# Altium project Mach_bao_khoi.PrjPcb
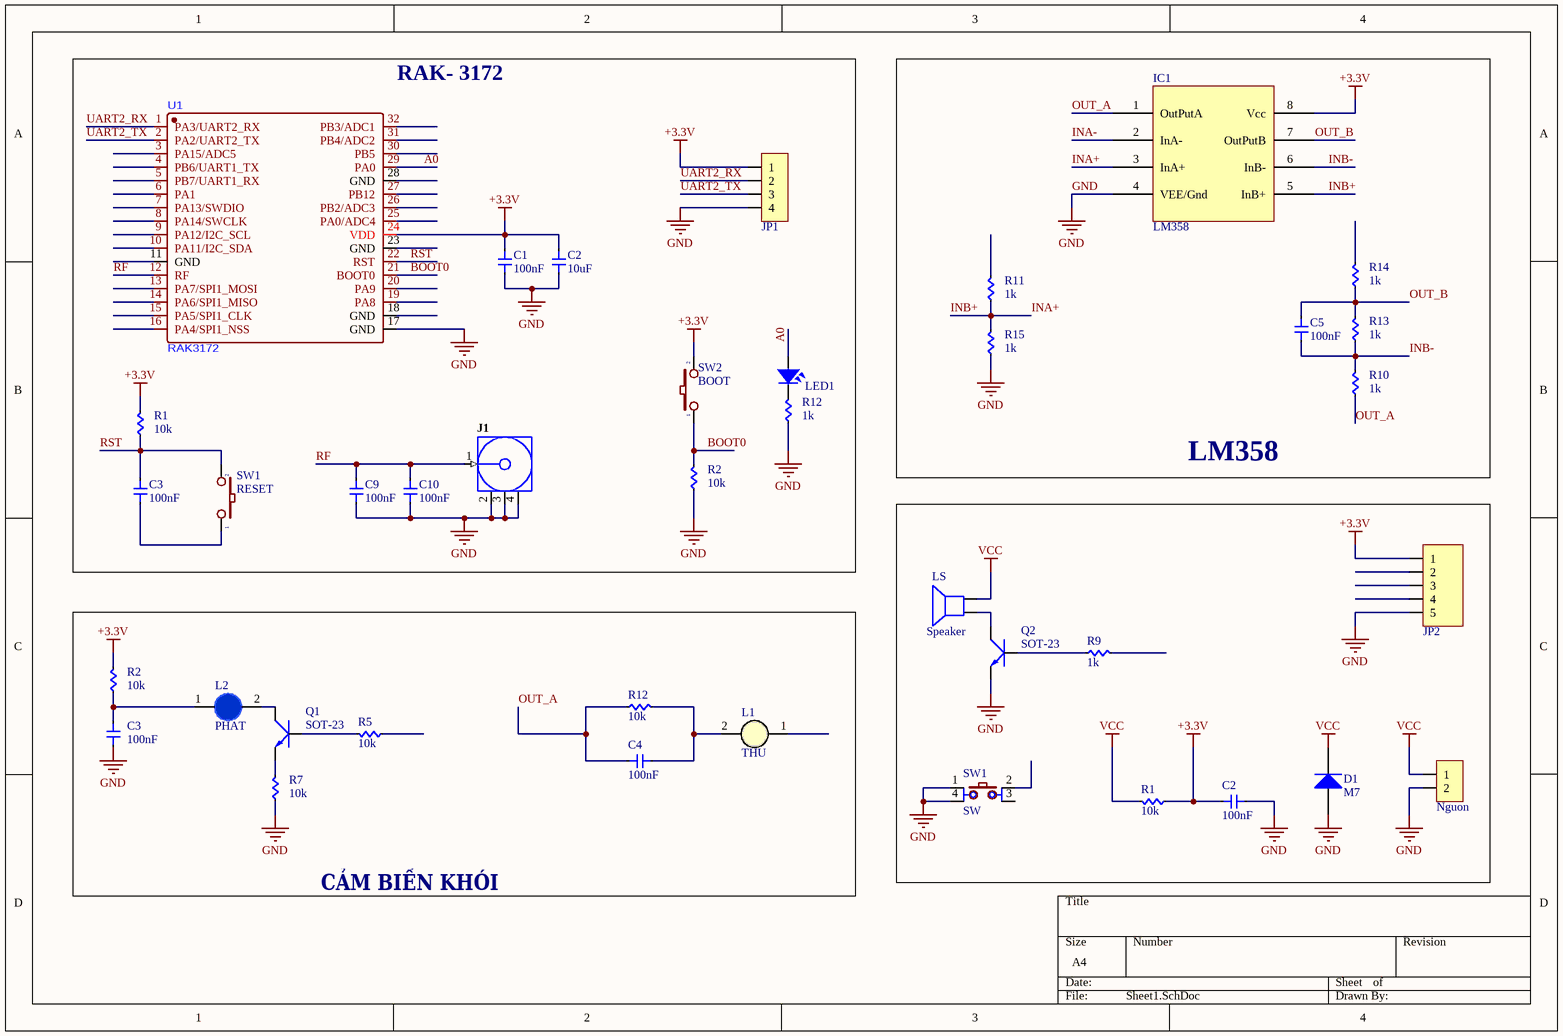
[diagram p0: Sheet1.SchDoc]
1 sheet, 39 parts. Net scope: global (net labels, ports and power ports of the same name join across sheets).
Board file: PCB1.PcbDoc

## Sheet Sheet1.SchDoc
size A4; SheetNumber: 1; SheetTotal: 1

### Parts
(Parts that share a designator on the sheet are numbered #1, #2 ... from top to bottom, then left to right.)
C1  100nF  [Cap 0603]
C2#1  10uF  [Cap 0603]
C2#2  100nF  [Cap 0603]
C3#1  100nF  [Cap 0603]
C3#2  100nF  [Cap 0603]
C4  100nF  [Cap 0603]
C5  100nF  [Cap 0603]
C9  100nF  [Cap 0603]
C10  100nF  [Cap 0603]
D1  M7  [DIODE SMA]
IC1  LM358  [SOP 8]
J1  (no value)  [CON RF]
JP1  JP1  [JP 1x4 DT]
JP2  JP2  [JP 1x5 DT]
JP?  Nguon  [JP 1x2 DT]
L1  THU  [LED-5MM-WHITE]
L2  PHAT  [LED-5MM-BLUE]
LED1  LED  [LED-0805-Green]  (value not drawn)
LS  Speaker  [Coi Chip Speacker]
Q1  SOT-23  [SOT-23]
Q2  SOT-23  [SOT-23]
R1#1  10k  [RES 0603]
R1#2  10k  [RES 0603]
R2#1  10k  [RES 0603]
R2#2  10k  [RES 0603]
R5  10k  [RES 0603]
R7  10k  [RES 0603]
R9  1k  [RES 0603]
R10  1k  [RES 0603]
R11  1k  [RES 0603]
R12#1  1k  [RES 0603]
R12#2  10k  [RES 0603]
R13  1k  [RES 0603]
R14  1k  [RES 0603]
R15  1k  [RES 0603]
SW1#1  RESET  [SW1-SMD]
SW1#2  SW  [SW2-DIP]
SW2  BOOT  [SW1-SMD]
U1  RAK3172  [LCC-40_L15.6-W15.0-P1.00_RAK3172]

### Blocks framed on the sheet
RAK- 3172: C1 C2#1 C3#1 C9 C10 J1 JP1 LED1 R1#1 R2#1 R12#1 SW1#1 SW2 U1
LM358: C5 IC1 R10 R11 R13-R15
CẢM BIẾN KHÓI: C3#2 C4 L1 L2 Q1 R2#2 R5 R7 R12#2

### Nets
+3.3V: C1.2 C2#1.1 C2#2.1 IC1.8(Vcc) JP1.1 JP2.1 R1#1.2 R1#2.1 R2#2.2 SW2.2 U1.24(VDD)
GND: C1.1 C2#1.2 C2#2.2 C3#2.1 C9.2 C10.1 D1.1(A) IC1.4(VEE/Gnd) J1.2(GND) J1.3(GND) J1.4(GND) JP1.4 JP2.5 JP?.2 Q2.2(E) R2#1.1 R7.1 R12#1.1 R15.1 SW1#2.1 SW1#2.4 U1.17(GND)
VCC: D1.2(K) JP?.1 LS.2 R1#2.2
A0: LED1.1 U1.29(PA0)
BOOT0: R2#1.2 SW2.1 U1.21(BOOT0)
INA+: IC1.3(InA+) IC1.5(InB+) R11.1 R15.2  [also labelled INB+]
INA-: IC1.2(InA-)
INB-: C5.1 IC1.6(InB-) R10.2 R13.1
OUT_A: C4.2 IC1.1(OutPutA) R10.1 R12#2.1
OUT_B: C5.2 IC1.7(OutPutB) R13.2 R14.1
RF: C9.1 C10.2 J1.1(Signal) U1.12(RF)
RST: C3#1.2 R1#1.1 SW1#1.2 U1.22(RST)
UART2_RX: JP1.2 U1.1(PA3/UART2_RX)
UART2_TX: JP1.3 U1.2(PA2/UART2_TX)
NetC3#1_1: C3#1.1 SW1#1.1
NetC3#2_2: C3#2.2 L2.1(A) R2#2.1
NetC4_1: C4.1 L1.2(K) R12#2.2
NetL2_2: L2.2(K) Q1.3(C)
NetLED1_2: LED1.2 R12#1.2
NetLS_1: LS.1 Q2.3(C)
NetQ1_1: Q1.1(B) R5.2
NetQ1_2: Q1.2(E) R7.2
NetQ2_1: Q2.1(B) R9.1

Not connected (* = marked no-connect by the designer): JP2 2 3 4; L1 1(A); R5 1; R9 2; R11 2; R14 2; SW1#2 2 3; U1 3(PA15/ADC5) 4(PB6/UART1_TX) 5(PB7/UART1_RX) 6(PA1) 7(PA13/SWDIO) 8(PA14/SWCLK) 9(PA12/I2C_SCL) 10(PA11/I2C_SDA) 11(GND) 13(PA7/SPI1_MOSI) 14(PA6/SPI1_MISO) 15(PA5/SPI1_CLK) 16(PA4/SPI1_NSS) 18(GND) 19(PA8) 20(PA9) 23(GND) 25(PA0/ADC4) 26(PB2/ADC3) 27(PB12) 28(GND) 30(PB5) 31(PB4/ADC2) 32(PB3/ADC1)

### Library data of the parts
C1 C2#1 C2#2 C3#1 C3#2 C4 C5 C9 C10 = Cap 0603: Capacitor SMD 0603
D1 = Diode M7 ( 4007 ): Dán; Don_Vi: Con; Ten_Linh_Kien: Diode M7 1N4007 SMD 1A 1000V; Ma_Hang: MH000944; Chung_Loai: Dán; Ghi_Chu: *
IC1 = LM358 SOP8: Dán; Ma_Hang: MH000609; Don_Vi: Con; Ten_Linh_Kien: LM358 SOP8; Kieu_Chan: *; Ghi_Chu: *; Chung_Loai: Dán
J1 = CON RF: Microcoaxial RF, 50 Ohm, PCB Vertical Jack Receptacle, SMT, 1.25mm Mounted Height; Sub-class: Serial Bus; IEC-class: Connector; Body Length: 4 mm; Datasheet: http://www.molex.com/webdocs/datasheets/pdf/en-us/0734120110_RF_COAX_CONNECTORS.pdf; Terminal Pitch: 3 mm; Class: Connector
JP1 = JP 1x4 2.54 Duc Thang: Cắm; Ten_Linh_Kien: Jump Đơn Đực 2.54MM 1x40P Thẳng 11MM; Don_Vi: Con; Ma_Hang: MH000903; Ghi_Chu: *; Kieu_Chan: *; Chung_Loai: Cắm
JP2 = JP 1x5 2.54 Duc Thang: Cắm; Ten_Linh_Kien: Jump Đơn Đực 2.54MM 1x40P Thẳng 11MM; Don_Vi: Con; Ma_Hang: MH000903; Ghi_Chu: *; Kieu_Chan: *; Chung_Loai: Cắm
JP? = JP 1x2 2.54 Duc Thang: Cắm; Ten_Linh_Kien: Jump Đơn Đực 2.54MM 1x40P Thẳng 11MM; Don_Vi: Con; Ma_Hang: MH000903; Ghi_Chu: *; Kieu_Chan: *; Chung_Loai: Cắm
L1 = LED 5mm Trang: Cắm; Don_Vi: Con; Ma_Hang: MH008983; Ten_Linh_Kien: Led 5MM Trắng Đục (1000c); Ghi_Chu: *; Kieu_Chan: *; Chung_Loai: Cắm
L2 = LED 5mm Xanh Duong: Cắm; Don_Vi: Con; Ma_Hang: MH008987; Ten_Linh_Kien: Led 5MM Xanh Dương Đục (1000c); Ghi_Chu: *; Kieu_Chan: *; Chung_Loai: Cắm
LED1 = LED SMD: Value: LED 3 - 5 ly 2 Colour
LS = Coi Chip Speaker: Còi chip
Q1 Q2 = Trans C1815 HF SMD: Value: C9014
R1#1 R1#2 R2#1 R2#2 R5 R7 R12#2 = RES 0603: RES SMD 0603; Manufacturer: Vishay Dale; Manufacturer Part Number: CRCW040210K0FKED; Tolerance: ±1%; Power (Watts): 0.063W, 1/16W; Temperature Coefficient: ±100ppm/°C; Supplier 1: Digi-Key; RoHS: RoHS Compliant; Category: Resistors; Stock 1: 2392462; Pricing 1: 10=0.083, 50=0.0444, 200=0.0255, 1000=0.0174 (USD); Packaging: Cut Tape (CT); Resistance (Ohms): 10k; Composition: Thick Film; Features: Automotive AEC-Q200; Operating Temperature: -55°C ~ 155°C; Package / Case: 0402 (1005 Metric); Supplier Device Package: 0402 (1005 Metric); Size / Dimension: 0.039" L x 0.020" W (1.00mm x 0.50mm); Height: 0.016" (0.40mm); Number of Terminations: 2; ComponentLink1URL: http://www.vishay.com/docs/20035/dcrcwe3.pdf; ComponentLink1Description: http://www.vishay.com/docs/20035/dcrcwe3.pdf; Supplier Part Number 1: 541-10.0KLCT-ND
R9-R11 R12#1 R13-R15 = RES 0603: RES SMD 0603; Manufacturer: Vishay Dale; Manufacturer Part Number: CRCW040210K0FKED; Resistance (Ohms): 10k; Tolerance: ±1%; Power (Watts): 0.063W, 1/16W; Temperature Coefficient: ±100ppm/°C; Supplier 1: Digi-Key; RoHS: RoHS Compliant; Category: Resistors; Stock 1: 2392462; Pricing 1: 10=0.083, 50=0.0444, 200=0.0255, 1000=0.0174 (USD); Packaging: Cut Tape (CT); Composition: Thick Film; Features: Automotive AEC-Q200; Operating Temperature: -55°C ~ 155°C; Package / Case: 0402 (1005 Metric); Supplier Device Package: 0402 (1005 Metric); Size / Dimension: 0.039" L x 0.020" W (1.00mm x 0.50mm); Height: 0.016" (0.40mm); Number of Terminations: 2; ComponentLink1URL: http://www.vishay.com/docs/20035/dcrcwe3.pdf; ComponentLink1Description: http://www.vishay.com/docs/20035/dcrcwe3.pdf; Supplier Part Number 1: 541-10.0KLCT-ND
SW1#1 SW2 = SW2: Switch button 2 pin; Value: SW chip 2 pin
SW1#2 = SW4: Switch button 4 pin; Value: Button chip 4 pin
U1 = RAK3172 (EU868, WITHOUT IPEX)